# Altium schematic sheet config-bank8.SchDoc: Config FPGA - Bank 8
size Letter; CompanyName: Brinton Engineering, LLC; Address1: 3479 Edison Way; Address2: Menlo Park CA 94025; Address3: +1 (877) 778-8435; Address4: brintonengineering.com; Revision: 1; SheetNumber: 1; SheetTotal: 1
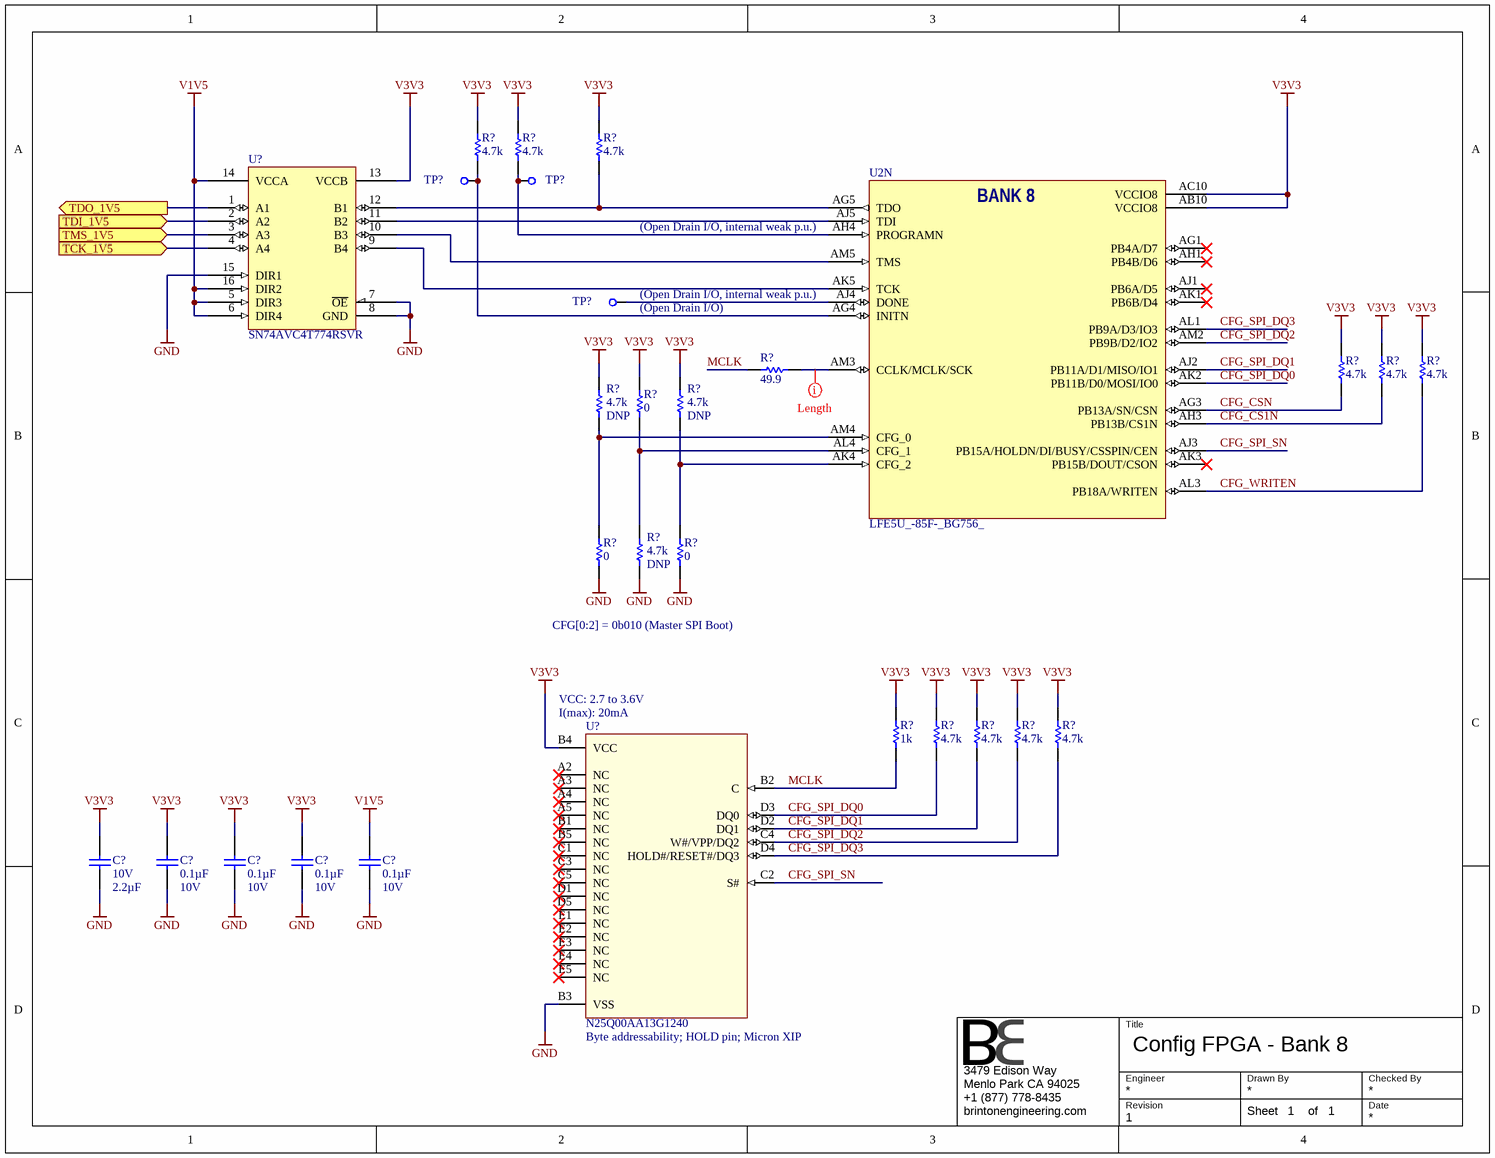
[diagram p0: config-bank8.SchDoc]

## Parts
(Parts that share a designator on the sheet are numbered #1, #2 ... from top to bottom, then left to right.)
C?#1  Voltage - Rated: 10V  Capacitance: 2.2µF  [CAPC1608X90N]  (hidden comment: GRM188R71A225KE15D)
C?#2  Capacitance: 0.1µF  Voltage - Rated: 10V  [CAPC1005X56N]  (hidden comment: GRM155R71A104KA01J)
C?#3  Capacitance: 0.1µF  Voltage - Rated: 10V  [CAPC1005X56N]  (hidden comment: GRM155R71A104KA01J)
C?#4  Capacitance: 0.1µF  Voltage - Rated: 10V  [CAPC1005X56N]  (hidden comment: GRM155R71A104KA01J)
C?#5  Capacitance: 0.1µF  Voltage - Rated: 10V  [CAPC1005X56N]  (hidden comment: GRM155R71A104KA01J)
R?#1  value 4.7k  [0603]  (hidden comment: RES 0603 4.7k 1%)
R?#2  value 4.7k  [0603]  (hidden comment: RES 0603 4.7k 1%)
R?#3  value 4.7k  [0603]  (hidden comment: RES 0603 4.7k 1%)
R?#4  value 49.9  [0603]  (hidden comment: RES 0603 49.9 1%)
R?#5  value 4.7k  [0603]  (hidden comment: RES 0603 4.7k 1%)
R?#6  value 4.7k  [0603]  (hidden comment: RES 0603 4.7k 1%)
R?#7  value 4.7k  [0603]  (hidden comment: RES 0603 4.7k 1%)
R?#8  value 4.7k  Do Not Place: DNP  [0603]  (hidden comment: RES 0603 4.7k 1%)
R?#9  value 0  [0603]  (hidden comment: RES 0603 0)
R?#10  value 4.7k  Do Not Place: DNP  [0603]  (hidden comment: RES 0603 4.7k 1%)
R?#11  value 0  [0603]  (hidden comment: RES 0603 0)
R?#12  value 4.7k  Do Not Place: DNP  [0603]  (hidden comment: RES 0603 4.7k 1%)
R?#13  value 0  [0603]  (hidden comment: RES 0603 0)
R?#14  value 1k  [0603]  (hidden comment: RES 0603 1k 1%)
R?#15  value 4.7k  [0603]  (hidden comment: RES 0603 4.7k 1%)
R?#16  value 4.7k  [0603]  (hidden comment: RES 0603 4.7k 1%)
R?#17  value 4.7k  [0603]  (hidden comment: RES 0603 4.7k 1%)
R?#18  value 4.7k  [0603]  (hidden comment: RES 0603 4.7k 1%)
TP?#1  TEST_POINT_SMD_10  [TEST_POINT_SMD_10]  (value not drawn)  (no BOM)
TP?#2  TEST_POINT_SMD_10  [TEST_POINT_SMD_10]  (value not drawn)  (no BOM)
TP?#3  TEST_POINT_SMD_10  [TEST_POINT_SMD_10]  (value not drawn)  (no BOM)
U2  LFE5U_-85F-_BG756_  [caBGA756]  (part N of 19)
U?#1  SN74AVC4T774RSVR  [RSV]
U?#2  N25Q00AA13G1240  [L-PBGA-24]

## Ports
TCK_1V5 (in), TDI_1V5 (in), TDO_1V5 (out), TMS_1V5 (in)

## Nets
GND: C?#1.1 C?#2.1 C?#3.1 C?#4.1 C?#5.1 R?#11.1 R?#12.1 R?#13.1 U?#1.7(~{OE}) U?#1.8(GND) U?#1.15(DIR1) U?#2.B3(VSS)
V1V5: C?#5.2 U?#1.5(DIR3) U?#1.6(DIR4) U?#1.14(VCCA) U?#1.16(DIR2)
V3V3: C?#1.2 C?#2.2 C?#3.2 C?#4.2 R?#1.2 R?#2.2 R?#3.2 R?#5.2 R?#6.2 R?#7.2 R?#8.2 R?#9.2 R?#10.2 R?#14.2 R?#15.2 R?#16.2 R?#17.2 R?#18.2 U2.AB10(VCCIO8) U2.AC10(VCCIO8) U?#1.13(VCCB) U?#2.B4(VCC)
CFG_CS1N: R?#6.1 U2.AH3(PB13B/CS1N)
CFG_CSN: R?#5.1 U2.AG3(PB13A/SN/CSN)
CFG_SPI_DQ0: R?#15.1 U2.AK2(PB11B/D0/MOSI/IO0) U?#2.D3(DQ0)
CFG_SPI_DQ1: R?#16.1 U2.AJ2(PB11A/D1/MISO/IO1) U?#2.D2(DQ1)
CFG_SPI_DQ2: R?#17.1 U2.AM2(PB9B/D2/IO2) U?#2.C4(W#/VPP/DQ2)
CFG_SPI_DQ3: R?#18.1 U2.AL1(PB9A/D3/IO3) U?#2.D4(HOLD#/RESET#/DQ3)
CFG_SPI_SN: U2.AJ3(PB15A/HOLDN/DI/BUSY/CSSPIN/CEN) U?#2.C2(S#)
CFG_WRITEN: R?#7.1 U2.AL3(PB18A/WRITEN)
MCLK: R?#4.2 R?#14.1 U?#2.B2(C)
TCK_1V5: U?#1.4(A4) ; port TCK_1V5
TDI_1V5: U?#1.2(A2) ; port TDI_1V5
TDO_1V5: U?#1.1(A1) ; port TDO_1V5
TMS_1V5: U?#1.3(A3) ; port TMS_1V5
NetR?#1_1: R?#1.1 TP?#1.1 U2.AG4(INITN)
NetR?#2_1: R?#2.1 TP?#2.1 U2.AH4(PROGRAMN)
NetR?#3_1: R?#3.1 U2.AG5(TDO) U?#1.12(B1)
NetR?#4_1: R?#4.1 U2.AM3(CCLK/MCLK/SCK)
NetR?#8_1: R?#8.1 R?#11.2 U2.AM4(CFG_0)
NetR?#9_1: R?#9.1 R?#12.2 U2.AL4(CFG_1)
NetR?#10_1: R?#10.1 R?#13.2 U2.AK4(CFG_2)
NetTP?#3_1: TP?#3.1 U2.AJ4(DONE)
NetU2_AJ5: U2.AJ5(TDI) U?#1.11(B2)
NetU2_AK5: U2.AK5(TCK) U?#1.9(B4)
NetU2_AM5: U2.AM5(TMS) U?#1.10(B3)

Not connected (* = marked no-connect by the designer): U2 AG1(PB4A/D7)* AH1(PB4B/D6)* AJ1(PB6A/D5)* AK1(PB6B/D4)* AK3(PB15B/DOUT/CSON)*; U?#2 A2(NC)* A3(NC)* A4(NC)* A5(NC)* B1(NC)* B5(NC)* C1(NC)* C3(NC)* C5(NC)* D1(NC)* D5(NC)* E1(NC)* E2(NC)* E3(NC)* E4(NC)* E5(NC)*

## Layout directives
rule Length Constraint [Min Length = 0mil    Max Length = 2000mil]: NetR?#4_1

## Notes on the sheet
- (near U2) (Open Drain I/O, internal weak p.u.)
- (near TP?#3) (Open Drain I/O)
- CFG[0:2] = 0b010 (Master SPI Boot)
- (near U?#2) VCC: 2.7 to 3.6V
- (near U?#2) I(max): 20mA
- (near U?#2) Byte addressability; HOLD pin; Micron XIP
- Title
- Engineer
- Revision
- Drawn By
- Checked By
- Date
- Sheet
- of
- (in symbol LFE5U_-85F-_BG756_, part N) BANK 8

## Library data of the parts
C?#1 = GRM188R71A225KE15D: CAP CER 2.2UF 10V 10% X7R 0603; Manufacturer: Murata Electronics North America; Manufacturer P/N: GRM188R71A225KE15D; Operating Temperature: -55°C ~ 125°C; Thickness (Max): 0.035" (0.90mm); Tolerance: ±10%; Package / Case: 0603 (1608 Metric); Temperature Coefficient: X7R; Supplier 1: Newark; Supplier 2: Digi-Key; RoHS: RoHS Compliant; Size / Dimension: 0.063" L x 0.031" W (1.60mm x 0.80mm); Mounting Type: Surface Mount, MLCC; ComponentLink1URL: http://www.murata.com/~/media/webrenewal/support/library/catalog/products/capacitor/mlcc/c02e.ashx; ComponentLink1Description: http://www.murata.com/~/media/webrenewal/support/library/catalog/products/capacitor/mlcc/c02e.ashx; Supplier Part Number 1: 72R4209; Supplier Part Number 2: 490-4520-1-ND
C?#2-C?#5 = GRM155R71A104KA01J: CAP CER 0.1UF 10V 10% X7R 0402; Manufacturer: Murata Electronics North America; Manufacturer P/N: GRM155R71A104KA01J; Operating Temperature: -55°C ~ 125°C; Thickness (Max): 0.022" (0.55mm); Size / Dimension: 0.039" L x 0.020" W (1.00mm x 0.50mm); RoHS: RoHS Compliant; Mounting Type: Surface Mount, MLCC; Supplier 1: Digi-Key; ComponentLink1URL: http://www.murata.com/~/media/webrenewal/support/library/catalog/products/capacitor/mlcc/c02e.ashx; ComponentLink1Description: http://www.murata.com/~/media/webrenewal/support/library/catalog/products/capacitor/mlcc/c02e.ashx; Supplier Part Number 1: 490-6322-1-ND; Temperature Coefficient: X7R; Package / Case: 0402 (1005 Metric); Tolerance: ±10%
R?#1-R?#3 R?#5-R?#8 R?#10 R?#12 R?#15-R?#18 = RES 0603 10k 1%: Thick Film Resistor 4.7k Ohms +/-1% 0.1W 75V SMD 0603; Manufacturer: Panasonic - ECG; Manufacturer P/N: ERJ3EKF4701V; Tcr: +/-100; Tr: -55:+155; Tolerance: +/-1%; Alternatives: *; Voltage: 75V; Power: 0.1W; P/N: ERJ3EKF4701V
R?#4 = RES 0603 10k 1%: Thick Film Resistor 49.9 Ohms +/-1% 0.1W 75V SMD 0603; Manufacturer: Panasonic - ECG; Manufacturer P/N: ERJ-3EKF49R9V; Tcr: +/-100; Tr: -55:+155; Tolerance: +/-1%; Alternatives: *; Voltage: 75V; Power: 0.1W; P/N: ERJ-3EKF49R9V
R?#9 R?#11 R?#13 = RES 0603 10k 1%: Thick Film Resistor 0 Ohms SMD 0603; Manufacturer: Panasonic - ECG; Manufacturer P/N: ERJ-3GEY0R00V; Tcr: +/-100; Tolerance: +/-1%; Tr: -55:+155; Voltage: 75V; Power: 0.1W; Alternatives: *; P/N: ERJ-3GEY0R00V
R?#14 = RES 0603 10k 1%: Thick Film Resistor 1k Ohms +/-1% 0.1W 75V SMD 0603; Manufacturer: Panasonic - ECG; Manufacturer P/N: ERJ3EKF1001V; Tcr: +/-100; Tr: -55:+155; Tolerance: +/-1%; Alternatives: *; Voltage: 75V; Power: 0.1W; P/N: ERJ3EKF1001V
TP?#1-TP?#3 = TEST_POINT_SMD_10: Test Point SMD
U2 = LFE5U_-85F-_BG756_: ECP5 FPGA, 85k LUT, 756-caBGA; Manufacturer: Lattice Semiconductor; Manufacturer P/N: LFE5U_-85F-_BG756_
U?#1 = SN74AVC4T774RSVR: 4-Bit Dual-Supply Bus Transceiver; Manufacturer: Texas Instruments; Manufacturer P/N: SN74AVC4T774RSVR
U?#2 = N25Q00AA13G1240: 1024Mb, 3.3V Serial Flash Memory LBGA24; Manufacturer: Micron; Manufacturer P/N: N25Q00AA13G1240; Temperature: -40:85